# Altium schematic sheet AUX_40pin.SchDoc: RP2040 CNC
size B; Author: AM; CompanyName: Expatria Technologies; DrawnBy: A.Marles; Engineer: AM; Organization: Expatria Technolgoies; DocumentNumber: 29; SheetNumber: 29; SheetTotal: 30
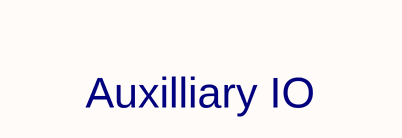
[diagram p0: AUX_40pin.SchDoc]

## Notes on the sheet
- Auxilliary IO
- SHEET
- Expatria Technologies
- 1136 Glade Court
- Port Coquitlam, BC V3B 1R5
- PHONE: (778) 238-9336
- PROJECT
- SIZE
- ENGR
- MODIFIED
- DOCUMENT
- REV
- Copyright Expatria Technologies 2022. This document describes Open Hardware and is licensed under the CERN-OHL-S v2. No warranty is implied or expressed.
- EMAIL: info@expatria.ca
- B
- /